# EAGLE design littleWire-PTH (EAGLE 6.1)
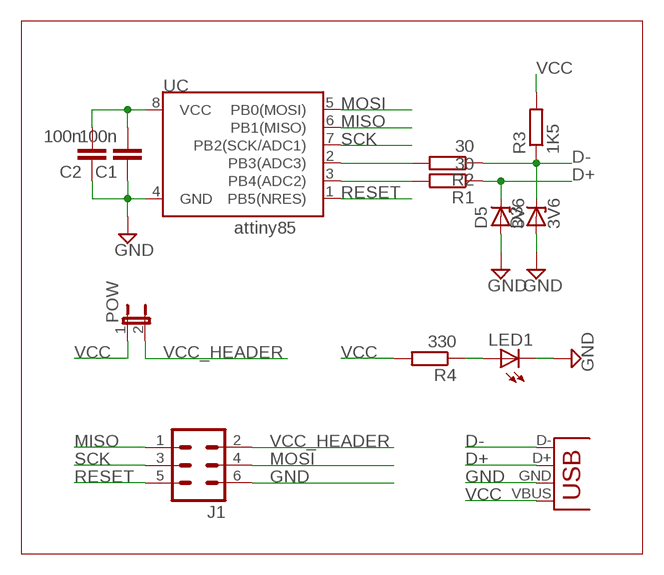
[diagram p0: schematic, sheet 1]

## Parts
C1  100n  C-EU025-025X050  [C025-025X050]
C2  100n  C-EU025-025X050  [C025-025X050]
D3  3V6  ZENER-DIODEZD-2.5  [ZDIO-2.5]
D5  3V6  ZENER-DIODEZD-7.5  [ZDIO-7.5]
J1  ML6  [ML6]
LED1  LED3MM  [LED3MM]
POW  JP1E  [JP1]
R1  30  R-EU_0207/2V  [0207/2V]
R2  30  R-EU_0207/2V  [0207/2V]
R3  1K5  R-EU_0207/2V  [0207/2V]
R4  330  R-EU_0207/2V  [0207/2V]
UC  ATTINY45DIP8  [DIP08]
X1  USB-A-H  [USB-A-H]

## Nets
D+: D5.C R1.1 X1.D+(D-)
D-: D3.C R2.1 R3.1 X1.D-(D+)
GND: C1.1 C2.1 D3.A D5.A J1.6 LED1.K(C) UC.4(GND) X1.GND(VBUS)
MISO: J1.1 UC.6(PB1(MISO))
MOSI: J1.4 UC.5(PB0(MOSI))
N$1: R2.2 UC.2(PB3(ADC3))
N$2: R1.2 UC.3(PB4(ADC2))
N$3: LED1.A R4.1
RESET: J1.5 UC.1(PB5(NRES))
SCK: J1.3 UC.7(PB2(SCK/ADC1))
VCC: C1.2 C2.2 POW.1 R3.2 R4.2 UC.8(VCC) X1.VBUS(GND)
VCC_HEADER: J1.2 POW.2

## Notes on the sheet
- attiny85

## Library data of the parts
C1 C2 = rcl:C-EU: CAPACITOR, European symbol
D3 D5 = diode:ZENER-DIODE: Z-Diode
J1 = con-ml:ML6: HARTING; OC_FARNELL: unknown; OC_NEWARK: unknown
LED1 = led:LED: LED OSRAM: - CHIPLED LG R971, LG N971, LY N971, LG Q971, LY Q971, LO R971, LY R971 LH N974, LH R974 LS Q976, LO Q976, LY Q976 LO Q996 - Hyper CHIPLED LW Q18S LB Q993, LB Q99A, LB R99A - SideLED LS A670, LO A670, LY A670, LG A670, LP A670 LB A673, LV A673, LT A673, LW A673 LH A674 LY A675 LS A676, LA A676, LO A676, LY A676, LW A676 LS A679, LY A679, LG A679 - Hyper Micro SIDELED® LS Y876, LA Y876, LO Y876, LY Y876 LT Y87S - SmartLED LW L88C, LW L88S LB L89C, LB L89S, LG L890 LS L89K, LO L89K, LY L89K LS L896, LA L896, LO L896, LY L896 - TOPLED LS T670, LO T670, LY T670, LG T670, LP T670 LSG T670, LSP T670, LSY T670, LOP T670, LYG T670 LG T671, LOG T671, LSG T671 LB T673, LV T673, LT T673, LW T673 LH T674 LS T676, LA T676, LO T676, LY T676, LB T676, LH T676, LSB T676, LW T676 LB T67C, LV T67C, LT T67C, LS T67K, LO T67K, LY T67K, LW E67C LS E67B, LA E67B, LO E67B, LY E67B, LB E67C, LV E67C, LT E67C LW T67C LS T679, LY T679, LG T679 LS T770, LO T770, LY T770, LG T770, LP T770 LB T773, LV T773, LT T773, LW T773 LH T774 LS E675, LA E675, LY E675, LS T675 LS T776, LA T776, LO T776, LY T776, LB T776 LHGB T686 LT T68C, LB T68C - Hyper Mini TOPLED® LB M676 - Mini TOPLED Santana® LG M470 LS M47K, LO M47K, LY M47K Source: http://www.osram.convergy.de LUXEON: - LUMILED® LXK2-PW12-R00, LXK2-PW12-S00, LXK2-PW14-U00, LXK2-PW14-V00 LXK2-PM12-R00, LXK2-PM12-S00, LXK2-PM14-U00 LXK2-PE12-Q00, LXK2-PE12-R00, LXK2-PE12-S00, LXK2-PE14-T00, LXK2-PE14-U00 LXK2-PB12-K00, LXK2-PB12-L00, LXK2-PB12-M00, LXK2-PB14-N00, LXK2-PB14-P00, LXK2-PB14-Q00 LXK2-PR12-L00, LXK2-PR12-M00, LXK2-PR14-Q00, LXK2-PR14-R00 LXK2-PD12-Q00, LXK2-PD12-R00, LXK2-PD12-S00 LXK2-PH12-R00, LXK2-PH12-S00 LXK2-PL12-P00, LXK2-PL12-Q00, LXK2-PL12-R00 Source: www.luxeon.com KINGBRIGHT: KA-3528ASYC Source: www.kingbright.com
POW = jumper:JP1E: JUMPER
R1-R4 = rcl:R-EU_: RESISTOR, European symbol
UC = SparkFun:ATTINY45: Atmel ATTiny45
X1 = SparkFun:USB: USB Connectors USB-B-PTH is fully proven SKU : PRT-00139 USB-miniB is fully proven SKU : PRT-00587 USB-A-PCB is untested. USB-A-H is throughly reviewed, but untested. Spark Fun Electronics SKU : PRT-00437 USB-B-SMT is throughly reviewed, but untested. Needs silkscreen touching up. USB-A-S has not been used/tested USB-MB-H has not been used/tested

## Board
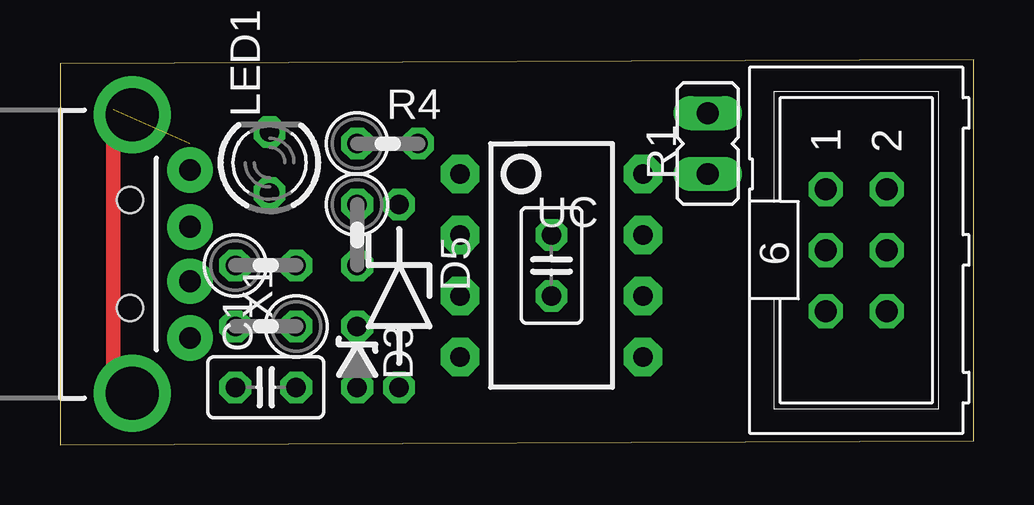
[diagram p1: board, top side]
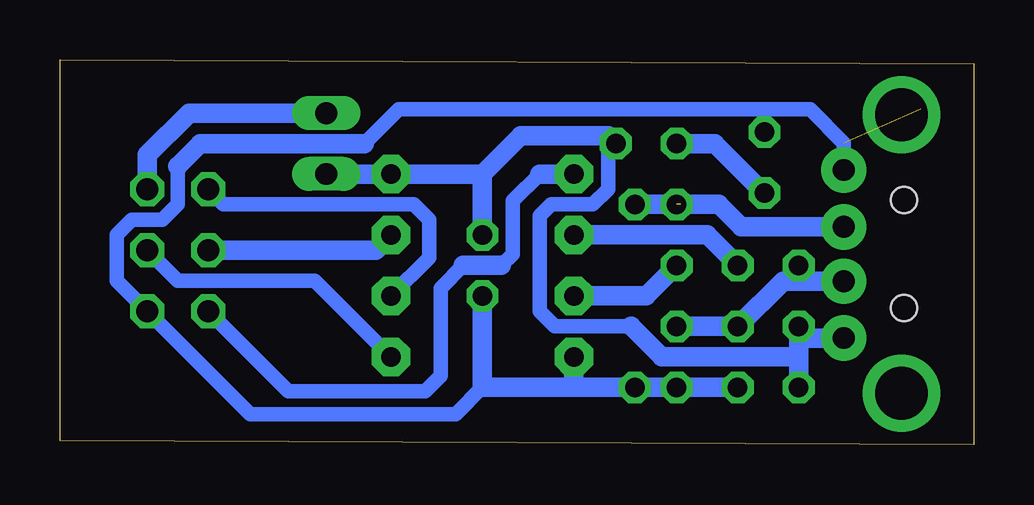
[diagram p2: board, bottom side, seen from below]

Size 38.08 x 16.02 mm. Coordinates in mm from the lower left corner, seen from the top.
Outline: 0,0 38.08,0.16 38.08,16.02 0,15.87 0,0
Copper layers (1*16): Top 0.035mm / dielectric 1.5mm / Bottom 0.035mm
Design rules: minimum track width 6mil, minimum drill 12mil, track to track 20mil, track to pad 20mil, pad to pad 20mil, via to via 20mil, smd to smd 8mil, copper to edge 4mil, drill to drill 4mil, minimum pad ring 10mil, minimum via ring 6mil, stop-mask expansion 2mil, vias tented up to drill 100mil, thermal gap 10mil

### Footprints (pad centres in the part's own frame; a part is rotated, then mirrored left to right if it is on the bottom)
C025-025X050 = drill 0.813 octagon: 1 -1.27,0; 2 1.27,0
ZDIO-2.5 = drill 0.813 octagon: A 1.27,0; C -1.27,0
ZDIO-7.5 = drill 0.813 octagon: A 3.81,0; C -3.81,0
ML6 = drill 0.914 octagon: 1 -2.54,-1.27; 2 -2.54,1.27; 3 0,-1.27; 4 0,1.27; 5 2.54,-1.27; 6 2.54,1.27
LED3MM = drill 0.813 octagon: A -1.27,0; K 1.27,0
JP1 = drill 0.914 long: 1 0,-1.27; 2 0,1.27
0207/2V = drill 0.813 octagon: 1 -1.27,0; 2 1.27,0
DIP08 = drill 0.813 pad 1.6 octagon: 1 -3.81,-3.81; 2 -1.27,-3.81; 3 1.27,-3.81; 4 3.81,-3.81; 5 3.81,3.81; 6 1.27,3.81; 7 -1.27,3.81; 8 -3.81,3.81
USB-A-H = drill 0.914 pad 1.88: D+ 2.4,1.127; D- 2.4,-1.127; GND 2.4,3.5; VBUS 2.4,-3.5 | drill 2.2: GND2 0,-5.8; GND3 0,5.8 | hole 1.1: -0.1,2.25; -0.1,-2.25

### Placement (x,y rotation side)
C1  20.48,7.46 90 top
C2  8.57,2.38 180 top
D3  12.38,3.65 270 top
D5  14.13,6.19 270 top
J1  33.18,8.1 270 top
LED1  8.73,11.75 90 top
POW  26.99,12.54 0 top
R1  12.38,8.73 270 top
R2  8.57,7.46 0 top
R3  8.57,4.92 180 top
R4  13.65,12.54 0 top
UC  20.48,7.46 270 top
X1  3.02,7.94 0 top

### Tracks (layer width: path | path; a pad name or v marks a point on that pad's centre or on a via)
D+  (1 unrouted)
  Bottom 0.61: 12.22,10 12.38,9.84
  Bottom 0.813: D5.C R1.1 | X1.D+ 9.7,9.06 10.64,10 12.22,10
D-
  Bottom 0.813: D3.C R3.1 7.95,6.81 7.3,6.81 | X1.D- 7.3,6.81 | R2.1 7.3,6.81
GND  (1 unrouted)
  Top 0.61: 2.22,2.38 2.22,13.97
  Bottom 0.61: 20.48,2.38 21.59,1.27 30.16,1.27 J1.6 35.72,6.83 35.72,8.73 35.08,9.37 33.81,9.37 33.18,10 33.18,11.59 | 8.73,13.97 6.83,13.97 5.42,12.56 X1.GND | LED1.K 8.73,13.97 | 8.73,13.97 23.97,13.97 25.4,12.54
  Bottom 0.813: C2.1 D3.A D5.A 16.67,2.38 | 16.67,2.38 20.48,2.38 C1.1 | UC.4 16.67,2.38 | 25.4,12.54 32.23,12.54 33.18,11.59
MISO
  Bottom 0.61: UC.6 22.7,7.78 22.7,9.37 23.34,10 31.27,10 J1.1
MOSI
  Bottom 0.61: UC.5 27.46,6.83 33.18,6.83 J1.4
N$1
  Bottom 0.61: R2.2
  Bottom 0.813: UC.2 11.11,8.73 R2.2
N$2
  Bottom 0.813: UC.3 13.65,6.19 R1.2
N$3
  Bottom 0.813: LED1.A 10.79,12.54 R4.1
RESET
  Bottom 0.61: 21.27,7.46 22.22,6.51 22.22,2.86 22.86,2.22 28.57,2.22 J1.5 | 18.1,11.27 19.21,10.16 19.21,7.94 19.68,7.46
  Bottom 0.813: UC.1 18.1,11.27 | 19.68,7.46 21.27,7.46
SCK
  Bottom 0.813: UC.7 24.92,8.1 J1.3
VCC
  Bottom 0.61: 7.29,4.44 7.3,4.29 | 14.29,4.92 17.46,4.92 18.1,5.56 18.1,9.52 17.62,10 15.87,10 15.24,10.64 15.24,12.7 15.4,12.86 | POW.1 | 22.38,11.27
  Bottom 0.813: C2.2 7.3,3.65 | R3.2 7.3,4.29 7.3,3.65 | 7.3,3.65 13.02,3.65 14.29,4.92 | X1.VBUS 7.29,4.44 | C1.2 20.48,11.27 | 20.48,11.27 22.38,11.27 UC.8 POW.1 | R4.2 15.24,12.86 15.4,12.86 18.89,12.86 20.48,11.27
VCC_HEADER
  Bottom 0.813: POW.2 32.7,13.81 34.45,12.06 J1.2

### Text on the board
_tsilk: power external board? | 100 nF | open hardware | +5V | mosi | gnd | 27 ohm | 27 ohm | 1.2 kohm | miso | sck | reset | tiny85 | 3.6V zeners | kehribar.me/projects/Little-Wire | 100 nF